# EAGLE schematic spice_amp_output (EAGLE 9.6.2)
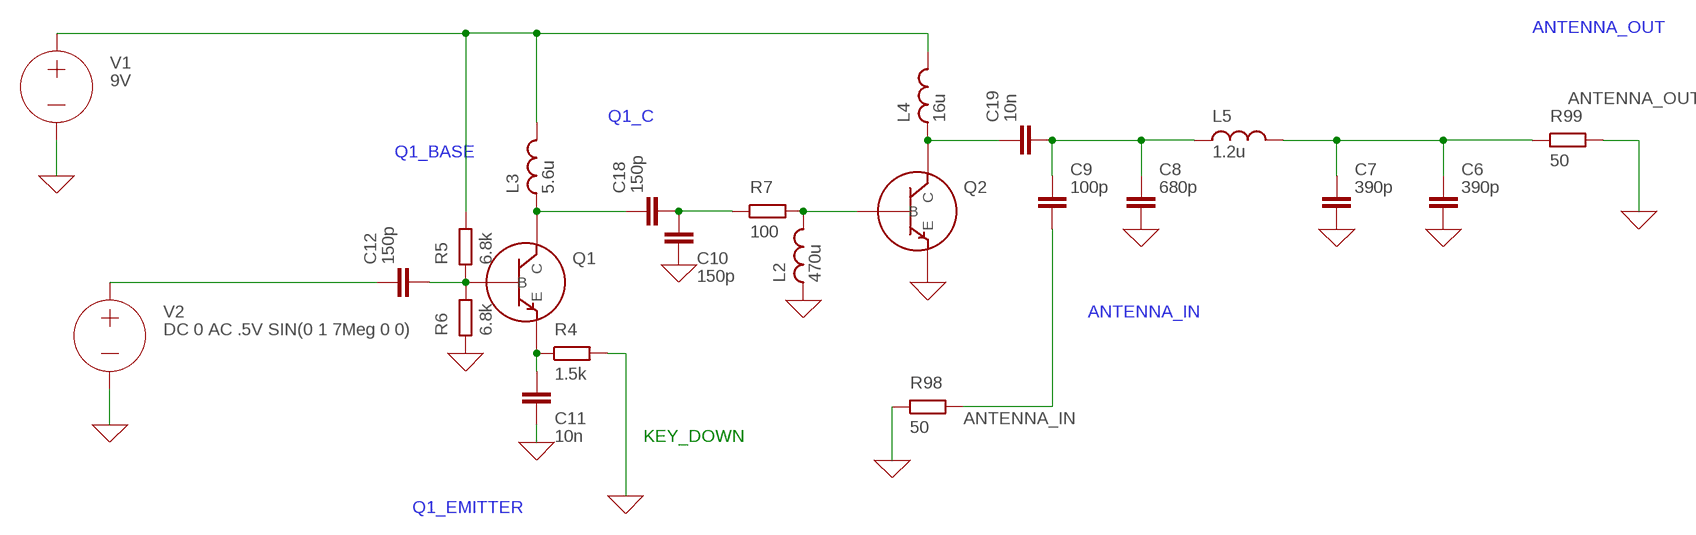
[diagram p0: schematic, sheet 1]

## Parts
C6  390p  C  (no package)
C7  390p  C  (no package)
C8  680p  C  (no package)
C9  100p  C  (no package)
C10  150p  C  (no package)
C11  10n  C  (no package)
C12  150p  C  (no package)
C18  150p  C  (no package)
C19  10n  C  (no package)
L2  470u  L  (no package)
L3  5.6u  L  (no package)
L4  16u  L  (no package)
L5  1.2u  L  (no package)
Q1  BJT_NPN  (no package)
Q2  BJT_NPN  (no package)
R4  1.5k  R  (no package)
R5  6.8k  R  (no package)
R6  6.8k  R  (no package)
R7  100  R  (no package)
R98  50  R  (no package)
R99  50  R  (no package)
V1  9V  VOLTAGE  (no package)
V2  DC 0 AC .5V SIN(0 1 7Meg 0 0)  VOLTAGE  (no package)

## Nets
0: C6.2 C7.2 C8.2 C10.2 C11.2 L2.1 Q2.E R4.2 R6.1 R98.1 R99.2 V1.- V2.- ; supply symbol labelled GND
ANTENNA_IN: C9.2 R98.2
ANTENNA_OUT: C6.1 C7.1 L5.2 R99.1
N$1: C12.1 V2.+
N$4: L3.2 L4.2 R5.2 V1.+
N$7: C10.1 C18.2 R7.1
N$8: L2.2 Q2.B R7.2
N$9: C19.1 L4.1 Q2.C
N$10: C8.1 C9.1 C19.2 L5.1
Q1_BASE: C12.2 Q1.B R5.1 R6.2
Q1_C: C18.1 L3.1 Q1.C
Q1_EMITTER: C11.1 Q1.E R4.1

## Notes on the sheet
- KEY_DOWN

## Library data of the parts
C6-C12 C18 C19 = ngspice-simulation:C: CAPACITOR
L2-L5 = ngspice-simulation:L: INDUCTOR
Q1 Q2 = ngspice-simulation:BJT_NPN: Bipolar NPN Transistor
R4-R7 R98 R99 = ngspice-simulation:R: RESISTOR
V1 V2 = ngspice-simulation:VOLTAGE: Independent Voltage Source, either DC, AC, PULSE, SINE, PWL, EXP, or SFFM; VALUE: 0V